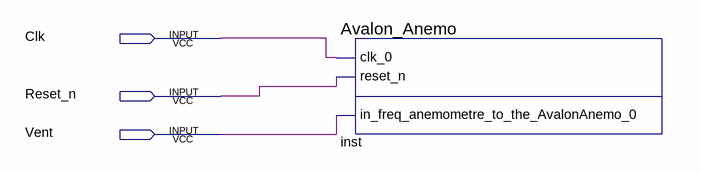
[diagram p0: schematic sheet]
// Quartus schematic Avalon_Anemo_Q11.bdf as structural Verilog: 1 symbols, 3 pins
module Avalon_Anemo_Q11 (
  input  Clk,
  input  Reset_n,
  input  Vent
);

  Avalon_Anemo inst (.clk_0(Clk), .reset_n(Reset_n), .in_freq_anemometre_to_the_AvalonAnemo_0(Vent));
endmodule
